# Altium schematic sheet GPS_GNSS.SchDoc
size A3; Author: İlker KESER; Revision: V1.0; SheetNumber: 8; SheetTotal: 9; Page: 8; Page Total: 9; Template: A3; Project Code: 02050838
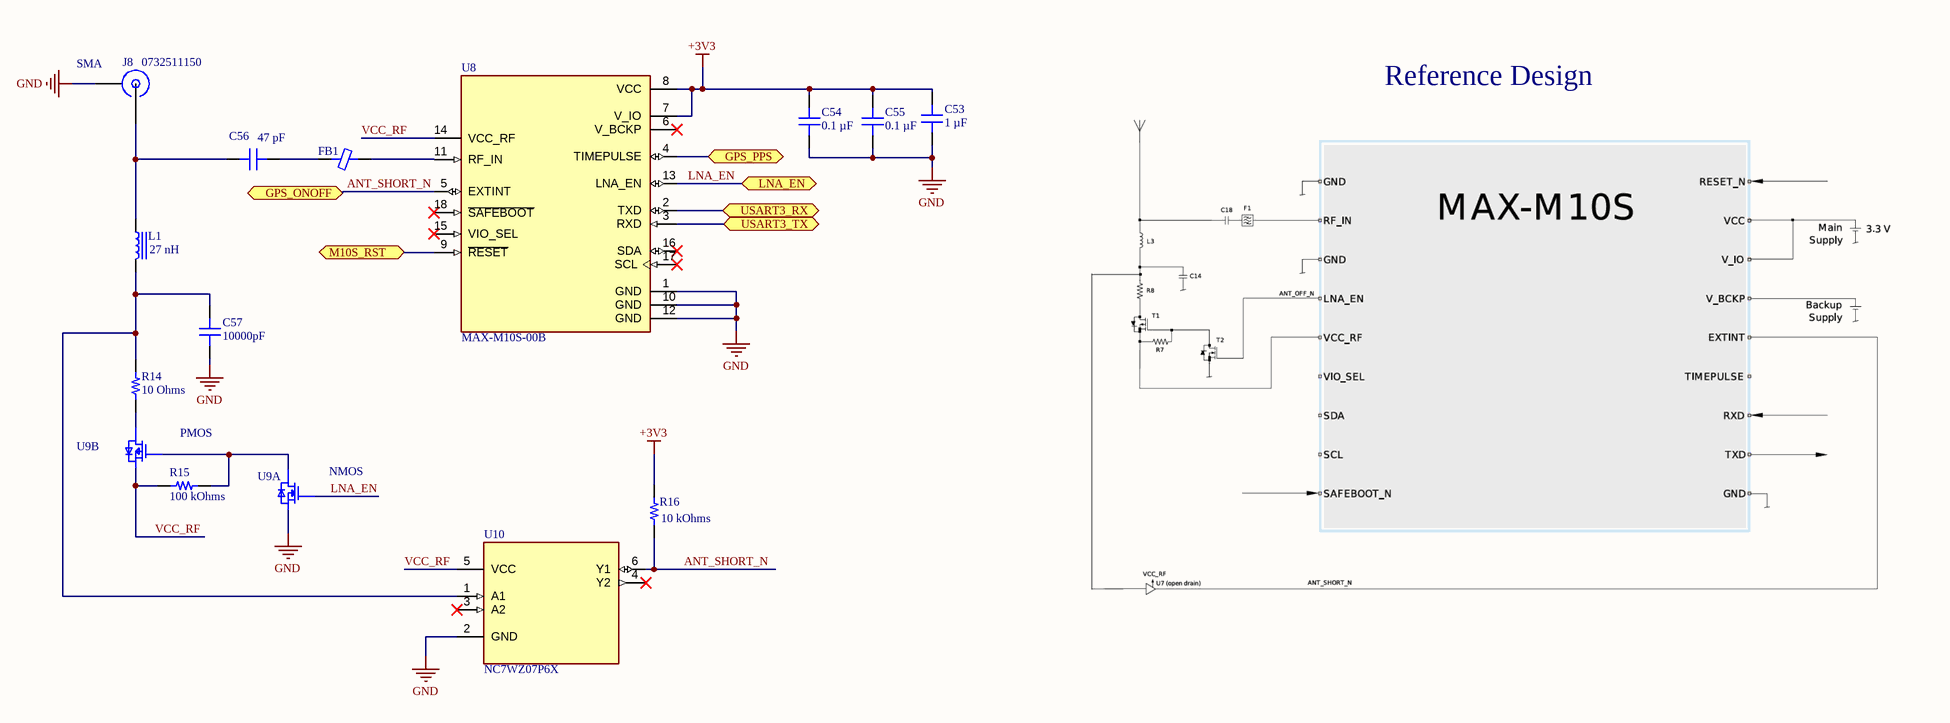
[diagram p0: GPS_GNSS.SchDoc]

## Parts
C53  1 µF  [MURATA GRM155 0402_1005]
C54  0.1 µF  [CAP 0402_1005]
C55  0.1 µF  [CAP 0402_1005]
C56  47 pF  [CAP 0402_1005]
C57  10000pF  [CAP 0603_1608 RF]
FB1  1 kOhms @ 100 MHz  [FER 0402_1005]  (value not drawn)
J8  0732511150  Connector Style: SMA  [MOLEX SD-73251-115]
L1  27 nH  [Murata LQG15 0402]
R14  10 Ohms  [YAGEO RES 0402_1005]
R15  100 kOhms  [YAGEO RES 0603_1608]
R16  10 kOhms  [KOA RES RK73 RN73 0402_1005]
U8  MAX-M10S-00B  [MAX-M10S-00B]
U9  DMC2700UDM-7  [SOT-23-6]  (value not drawn)  (parts A,B of 2)
U10  NC7WZ07P6X  [NC7WZ07P6X]

## Ports
GPS_ONOFF (bidir, see Microcontroller[2C]), GPS_PPS (bidir, see Microcontroller[2C]), LNA_EN (bidir, see Microcontroller[2C]), M10S_RST (bidir, see Microcontroller[2C]), USART3_RX (bidir, see Microcontroller[2B]), USART3_TX (bidir, see Microcontroller[2B])

## Nets
+3V3: C53.2 C54.2 C55.2 R16.1 U8.7(V_IO) U8.8(VCC)
GND: C53.1 C54.1 C55.1 C57.2 J8.G(GND) U8.1(GND) U8.10(GND) U8.12(GND) U9.5(S1) U10.2(GND)
ANT_SHORT_N: R16.2 U8.5(EXTINT) U10.6(Y1) ; port GPS_ONOFF
GPS_PPS: U8.4(TIMEPULSE) ; port GPS_PPS
LNA_EN: U8.13(LNA_EN) U9.1(G1) ; port LNA_EN
M10S_RST: U8.9(~{RESET}) ; port M10S_RST
USART3_RX: U8.2(TXD) ; port USART3_RX
USART3_TX: U8.3(RXD) ; port USART3_TX
VCC_RF: R15.1 U8.14(VCC_RF) U9.2(S2) U10.5(VCC)
NetC56_1: C56.1 J8.S(SIGNAL) L1.1
NetC56_2: C56.2 FB1.1
NetC57_1: C57.1 L1.2 R14.2 U10.1(A1)
NetFB1_2: FB1.2 U8.11(RF_IN)
NetR14_1: R14.1 U9.4(D2)
NetR15_2: R15.2 U9.3(G2) U9.6(D1)

Not connected (* = marked no-connect by the designer): U8 6(V_BCKP)* 15(VIO_SEL)* 16(SDA)* 17(SCL)* 18(~{SAFEBOOT})*; U10 3(A2)* 4(Y2)*

## Notes on the sheet
- Reference Design
- TITLE:
- DOCUMENT NAME:
- PROJECT CODE:
- TEMPLATE:
- REVISION:
- Sheet:
- of
- AUTHOR:
- (in symbol DMC2700UDM-7, part A) NMOS
- (in symbol DMC2700UDM-7, part B) PMOS

## Library data of the parts
C53 = GRM155Z71A105KE01J: CAP CER 1UF 10V X7R 0402; manufacturer: Murata Electronics; Tolerance: ±10%; Part Number: GRM155Z71A105KE01J; Capacitance: 1 µF; Applications: General Purpose; componentlink1description: Datasheet; componentlink1url: https://search.murata.co.jp/Ceramy/image/img/A01X/G101/ENG/GRM155Z71A105KE01-01A.pdf; componentlink2description: DigiKey Link; componentlink2url: https://www.digikey.com/en/products/detail/murata-electronics/GRM155Z71A105KE01J/16033607; Device Package: 0402 (1005 Metric); lastupdated: 27.08.2024 12:42:50; Lifecycle Status: Active; Minimum Order: 1; Mounting Type: Surface Mount, MLCC; Operating Temperature: -55°C ~ 125°C; Package / Case: 0402 (1005 Metric); packaging: TapeAndReel; partid: 41629; Part Status: Active; price: 0.01; series: GRM; Size / Dimension: 0.039" L x 0.020" W (1.00mm x 0.50mm); Supplier 1: DigiKey; Supplier Part Number 1: 490-GRM155Z71A105KE01JCT-ND; Temperature Coefficient: X7R; Thickness (Max): 0.024" (0.60mm); value: 1 µF; Voltage - Rated: 10V
C54 C55 = 885012205018: CAP CER 0.1UF 10V X7R 0402; manufacturer: Würth Elektronik; Tolerance: ±10%; Part Number: 885012205018; Capacitance: 0.1 µF; Applications: General Purpose; componentlink1description: Datasheet; componentlink1url: https://katalog.we-online.de/pbs/datasheet/885012205018.pdf; componentlink2description: DigiKey Link; componentlink2url: https://www.digikey.com/en/products/detail/würth-elektronik/885012205018/5453368; Device Package: 0402 (1005 Metric); lastupdated: 9.02.2024 20:04:24; Lifecycle Status: Active; Minimum Order: 1; Mounting Type: Surface Mount, MLCC; Operating Temperature: -55°C ~ 125°C; Package / Case: 0402 (1005 Metric); packaging: TapeAndReel; partid: 10108; Part Status: Active; price: 0.01; series: WCAP-CSGP; Size / Dimension: 0.039" L x 0.020" W (1.00mm x 0.50mm); Supplier 1: DigiKey; Supplier Part Number 1: 732-7513-1-ND; Temperature Coefficient: X7R; Thickness (Max): 0.022" (0.55mm); value: 0.1 µF; Voltage - Rated: 10V
C56 = C0402C470J3GACAUTO: CAP CER 47PF 25V C0G/NP0 0402; manufacturer: KEMET; Temperature Coefficient: C0G, NP0; Tolerance: ±5%; Part Number: C0402C470J3GACAUTO; Capacitance: 47 pF; Applications: Automotive; componentlink1description: Datasheet; componentlink1url: https://connect.kemet.com:7667/gateway/IntelliData-ComponentDocumentation/1.0/download/datasheet/C0402C470J3GACAUTO; componentlink2description: DigiKey Link; componentlink2url: https://www.digikey.com/en/products/detail/kemet/C0402C470J3GACAUTO/10642318; Device Package: 0402 (1005 Metric); Features: Low ESL; lastupdated: 9.02.2024 20:04:06; Lifecycle Status: Active; Minimum Order: 1; Mounting Type: Surface Mount, MLCC; Operating Temperature: -55°C ~ 125°C; Package / Case: 0402 (1005 Metric); packaging: TapeAndReel; partid: 47193; Part Status: Active; price: 0.01; Ratings: AEC-Q200; series: SMD Auto C0G; Size / Dimension: 0.039" L x 0.020" W (1.00mm x 0.50mm); Supplier 1: DigiKey; Supplier Part Number 1: 399-C0402C470J3GACAUTOCT-ND; Thickness (Max): 0.022" (0.55mm); value: 47 pF; Voltage - Rated: 25V
C57 = EMK107SD103KA-T: CAP CER 10000PF 16V 0603; manufacturer: Taiyo Yuden; Tolerance: ±10%; Part Number: EMK107SD103KA-T; Applications: RF, Microwave, High Frequency; Capacitance: 10000pF; componentlink1description: Datasheet; componentlink1url: http://www.yuden.co.jp/productdata/catalog/mlcc07_e.pdf; componentlink2description: DigiKey Link; componentlink2url: http://digikey.com/product-detail/en/taiyo-yuden/EMK107SD103KA-T/587-1094-1-ND/930871; Device Package: 0603 (1608 Metric); Features: Low Distortion; lastupdated: 2.09.2020 01:17:15; Lifecycle Status: Active; Minimum Order: 1; Mounting Type: Surface Mount, MLCC; Operating Temperature: -55°C ~ 125°C; Package / Case: 0603 (1608 Metric); packaging: TapeAndReel; partid: 1412; Part Status: Active; price: 0.07; series: CFCAP™; Size / Dimension: 0.063" L x 0.031" W (1.60mm x 0.80mm); Supplier 1: DigiKey; Supplier Part Number 1: 587-1094-1-ND; Thickness (Max): 0.035" (0.90mm); value: 10000pF; Voltage - Rated: 16V
FB1 = BLM15AG102SN1D: FERRITE BEAD 1K OHM 0402 1LN; Manufacturer: Murata Electronics; Current Rating (Max): 300mA; DC Resistance (DCR) (Max): 650mOhm; Number of Lines: 1; Part Number: BLM15AG102SN1D; ComponentLink1Description: Datasheet; ComponentLink1URL: https://www.murata.com/en-us/products/productdata/8796740059166/ENFA0018.pdf; ComponentLink2Description: DigiKey Link; ComponentLink2URL: https://www.digikey.com/en/products/detail/murata-electronics/BLM15AG102SN1D/584218; Device Package: 0402 (1005 Metric); Height (Max): 0.022" (0.55mm); Impedance @ Frequency: 1 kOhms @ 100 MHz; LastUpdated: 3.06.2024 19:51:04; Lifecycle Status: Active; Minimum Order: 1; Mounting Type: Surface Mount; Operating Temperature: -55°C ~ 125°C; Package / Case: 0402 (1005 Metric); Packaging: TapeAndReel; PartId: 387; Part Status: Active; Price: 0.01; Series: EMIFIL®, BLM15; Size / Dimension: 0.039" L x 0.022" W (1.00mm x 0.55mm); Supplier 1: DigiKey; Supplier Part Number 1: 490-1007-1-ND; Value: 1 kOhms @ 100 MHz
J8 = 0732511150: CONN SMA RCPT STR 50OHM EDGE MNT; Manufacturer: Molex; Connector Type: Receptacle, Female Socket; Contact Termination: Solder; Frequency - Max: 18 GHz; Number of Ports: 1; Part Number: 0732511150; ComponentLink1Description: Datasheet; ComponentLink1URL: https://www.molex.com/pdm_docs/ps/PS-89675-346.pdf; ComponentLink2Description: DigiKey Link; ComponentLink2URL: https://www.digikey.com/en/products/detail/molex/0732511150/1465156; Fastening Type: Threaded; Housing Color: Gold; Impedance: 50Ohm; LastUpdated: 29.06.2022 18:06:18; Lifecycle Status: Active; Minimum Order: 1; Mounting Type: Board Edge, End Launch; Packaging: Tray; Part Status: Active; Price: 2.16; Series: 73251; Shield Termination: Solder; Supplier 1: DigiKey; Supplier Part Number 1: WM5534-ND
L1 = LQG15HZ27NJ02D: FIXED IND 27NH 350MA 0.46OHM SMD; Manufacturer: Murata Electronics; DC Resistance (DCR): 460mOhm Max; Frequency - Self Resonant: 1.7GHz; Inductance Frequency - Test: 100 MHz; Material - Core: Air; Q @ Freq: 8 @ 100MHz; Shielding: Unshielded; Tolerance: ±5%; Type: Multilayer; Part Number: LQG15HZ27NJ02D; ComponentLink1Description: Datasheet; ComponentLink1URL: https://search.murata.co.jp/Ceramy/image/img/P02/JELF243B-9110.pdf; ComponentLink2Description: DigiKey Link; ComponentLink2URL: https://www.digikey.com/en/products/detail/murata-electronics/LQG15HZ27NJ02D/8323902; Current Rating (Amps): 350 mA; Device Package: 0402 (1005 Metric); Height - Seated (Max): 0.022" (0.55mm); Inductance: 27 nH; LastUpdated: 19.07.2024 23:59:46; Lifecycle Status: Active; Minimum Order: 1; Mounting Type: Surface Mount; Operating Temperature: -55°C ~ 125°C; Package / Case: 0402 (1005 Metric); Packaging: TapeAndReel; PartId: 2424; Part Status: Active; Price: 0.02; Ratings: AEC-Q200; Series: LQG15; Size / Dimension: 0.039" L x 0.020" W (1.00mm x 0.50mm); Supplier 1: DigiKey; Supplier Part Number 1: 490-LQG15HZ27NJ02DCT-ND; Supplier Device Package: 0402 (1005 Metric); Value: 27 nH
R14 = RC0402JR-0710RL: RES 10 OHM 5% 1/16W 0402; Manufacturer: Yageo; Power (Watts): 0.063W, 1/16W; Temperature Coefficient: ±200ppm/°C; Part Number: RC0402JR-0710RL; Value: 10 Ohms; ComponentLink1Description: Datasheet; ComponentLink1URL: https://www.yageo.com/upload/media/product/productsearch/datasheet/rchip/PYu-RC_Group_51_RoHS_L_10.pdf; ComponentLink2Description: DigiKey Link; ComponentLink2URL: https://www.digikey.com/en/products/detail/yageo/RC0402JR-0710RL/726417; Composition: Thick Film; Device Package: 0402 (1005 Metric); Features: Moisture Resistant; Height - Seated (Max): 0.016" (0.40mm); LastUpdated: 25.07.2024 09:18:18; Lifecycle Status: Active; Minimum Order: 1; Number of Terminations: 2; Operating Temperature: -55°C ~ 155°C; Package / Case: 0402 (1005 Metric); Packaging: CutTape; PartId: 3405; Part Status: Active; Price: 0.01; Resistance: 10 Ohms; Series: RC_L; Size / Dimension: 0.039" L x 0.020" W (1.00mm x 0.50mm); Supplier 1: DigiKey; Supplier Part Number 1: 311-10JRCT-ND; Supplier Device Package: 0402; Tolerance: ±5%
R15 = AA0603FR-07100KL: RES SMD 100K OHM 1% 1/10W 0603; Manufacturer: Yageo; Power (Watts): 0.1W, 1/10W; Temperature Coefficient: ±150ppm/°C; Part Number: AA0603FR-07100KL; Value: 100 kOhms; ComponentLink1Description: Datasheet; ComponentLink1URL: https://www.yageo.com/upload/media/product/productsearch/datasheet/rchip/PYu-AA_51_RoHS_L_3.pdf; ComponentLink2Description: DigiKey Link; ComponentLink2URL: https://www.digikey.com/en/products/detail/yageo/AA0603FR-07100KL/5888687; Composition: Thick Film; Device Package: 0603 (1608 Metric); Features: Anti-Sulfur, Automotive AEC-Q200, Moisture Resistant; Height - Seated (Max): 0.022" (0.55mm); LastUpdated: 25.07.2024 09:19:03; Lifecycle Status: Active; Minimum Order: 1; Number of Terminations: 2; Operating Temperature: -55°C ~ 155°C; Package / Case: 0603 (1608 Metric); Packaging: TapeAndReel; PartId: 78895; Price: 0.01; Ratings: AEC-Q200; Resistance: 100 kOhms; Series: AA; Size / Dimension: 0.063" L x 0.031" W (1.60mm x 0.80mm); Supplier 1: DigiKey; Supplier Part Number 1: 13-AA0603FR-07100KLCT-ND; Supplier Device Package: 0603; Tolerance: ±1%
R16 = RK73H1ETTP1002D: RES 10K OHM 0.5% 1/10W 0402; Manufacturer: KOA Speer Electronics, Inc.; Power (Watts): 0.1W, 1/10W; Temperature Coefficient: ±100ppm/°C; Part Number: RK73H1ETTP1002D; Value: 10 kOhms; ComponentLink1Description: Datasheet; ComponentLink1URL: http://www.koaspeer.com/catimages/Products/RK73H/RK73H.pdf; ComponentLink2Description: DigiKey Link; ComponentLink2URL: https://www.digikey.com/en/products/detail/koa-speer-electronics-inc/RK73H1ETTP1002D/9844692; Composition: Thick Film; Device Package: 0402 (1005 Metric); Features: Automotive AEC-Q200; Height - Seated (Max): 0.016" (0.40mm); LastUpdated: 25.07.2024 09:41:31; Lifecycle Status: Active; Minimum Order: 1; Number of Terminations: 2; Operating Temperature: -55°C ~ 155°C; Package / Case: 0402 (1005 Metric); Packaging: TapeAndReel; PartId: 14647; Part Status: Active; Price: 0.03; Ratings: AEC-Q200; Resistance: 10 kOhms; Series: RK73H; Size / Dimension: 0.039" L x 0.020" W (1.00mm x 0.50mm); Supplier 1: DigiKey; Supplier Part Number 1: 2019-RK73H1ETTP1002DCT-ND; Supplier Device Package: 0402; Tolerance: ±0.5%
U8 = MAX-M10S-00B: MAX-M10 RF Receiver BeiDou, Galileo, GLONASS, GPS, GNSS 1.561GHz, 1.575GHz, 1.602GHz -167dBm 921.6kbps Not Included Module; Manufacturer: ublox; Data Interface: I2C,UART; Voltage - Supply: 1.76V ~ 3.6V; Sensitivity: -167dBm; Frequency: 1.561GHz, 1.575GHz, 1.602GHz; Modulation or Protocol: BeiDou, Galileo, GLONASS, GPS, GNSS; Data Rate (Max): 921.6kbps; Applications: GPS/GNSS Receiver; Antenna Connector: Not Included; Operating Temperature: -40°C ~ 85°C; Mounting Type: Surface Mount; ComponentLink1Description: Datasheet; ComponentLink1URL: https://content.u-blox.com/sites/default/files/MAX-M10S_DataSheet_UBX-20035208.pdf; ComponentLink2Description: Digikey Link; ComponentLink2URL: https://www.digikey.com/en/products/detail/u-blox/max-m10s-00b/15712906
U9 = DMC2700UDM-7: Mosfet Array 20V 1.34A, 1.14A 1.12W Surface Mount SOT-26; Manufacturer: Diodes Incorporated; Configuration: N and P-Channel; FET Feature: Logic Level Gate; Rds On (Max) @ Id, Vgs: 400mOhm @ 600mA, 4.5V; Vgs(th) (Max) @ Id: 1V @ 250µA; Gate Charge (Qg) (Max) @ Vgs: 0.74nC @ 4.5V; Input Capacitance (Ciss) (Max) @ Vds: 60.67pF @ 16V; ComponentLink1Description: Datasheet; ComponentLink1URL: https://www.diodes.com/assets/Datasheets/DMC2700UDM.pdf; ComponentLink2Description: Digikey Link; ComponentLink2URL: https://www.digikey.com/en/products/detail/diodes-incorporated/DMC2700UDM-7/2765657; Technology: MOSFET (Metal Oxide); Drain to Source Voltage (Vdss): 20V; Current - Continuous Drain (Id) @ 25°C: 1.34A, 1.14A; Power - Max: 1.12W; Operating Temperature: -55°C ~ 150°C (TJ); Package / Case: SOT-23-6
U10 = NC7WZ07P6X: Buffer, Non-Inverting 2 Element 1 Bit per Element Open Drain Output SC-88 (SC-70-6); Manufacturer: onsemi; Number of Elements: 2; Number of Bits per Element: 1; Current - Output High, Low: -, 32mA; Voltage - Supply: 1.65V ~ 5.5V; Logic Type: Buffer, Non-Inverting; Output Type: Open Drain; Operating Temperature: -40°C ~ 85°C (TA); Mounting Type: Surface Mount; Package / Case: 6-TSSOP, SC-88, SOT-363; Supplier Device Package: SC-88 (SC-70-6); ComponentLink1Description: Datasheet; ComponentLink1URL: https://www.onsemi.com/pdf/datasheet/nc7wz07-d.pdf; ComponentLink2Description: Digikey link; ComponentLink2URL: https://www.digikey.com/en/products/detail/onsemi/nc7wz07p6x/965440